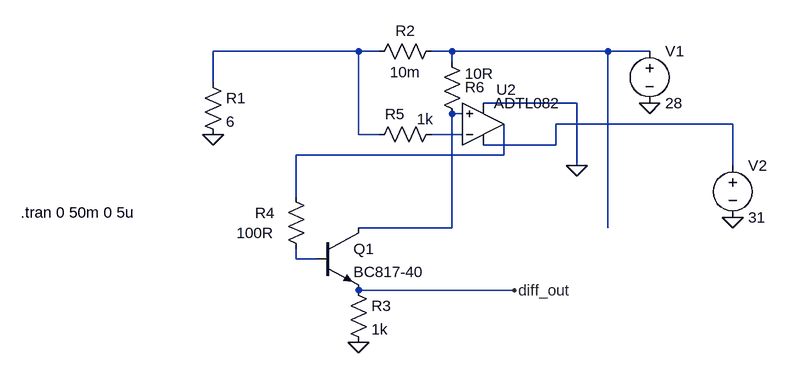
[diagram p0: schematic high_side_current_sense.asc]
high_side_current_sense.asc, the LTspice schematic file:
Version 4
SHEET 1 880 680
WIRE -16 32 -240 32
WIRE 16 32 -16 32
WIRE 128 32 96 32
WIRE 368 32 128 32
WIRE 432 32 368 32
WIRE 128 48 128 32
WIRE -240 80 -240 32
WIRE 320 112 176 112
WIRE 144 128 128 128
WIRE 560 144 288 144
WIRE -16 160 -16 32
WIRE 16 160 -16 160
WIRE 144 160 96 160
WIRE 288 176 288 144
WIRE 288 176 176 176
WIRE 208 192 208 144
WIRE 208 192 -112 192
WIRE 320 208 320 112
WIRE 560 208 560 144
WIRE -112 256 -112 192
WIRE 128 304 128 128
WIRE 128 304 -16 304
WIRE 368 304 368 32
WIRE -112 352 -112 336
WIRE -80 352 -112 352
WIRE 224 400 -16 400
FLAG 432 112 0
FLAG 320 208 0
FLAG -240 160 0
FLAG -16 480 0
FLAG 224 400 diff_out
FLAG 560 288 0
SYMBOL voltage 432 16 R0
WINDOW 123 0 0 Left 0
WINDOW 39 0 0 Left 0
SYMATTR InstName V1
SYMATTR Value 28
SYMBOL res -256 64 R0
SYMATTR InstName R1
SYMATTR Value 6
SYMBOL res 112 16 R90
WINDOW 0 0 56 VBottom 2
WINDOW 3 32 56 VTop 2
SYMATTR InstName R2
SYMATTR Value 10m
SYMBOL npn -80 304 R0
SYMATTR InstName Q1
SYMATTR Value BC817-40
SYMBOL res -32 384 R0
SYMATTR InstName R3
SYMATTR Value 1k
SYMBOL res 112 144 R90
WINDOW 0 0 72 VBottom 2
WINDOW 3 -23 25 VTop 2
SYMATTR InstName R5
SYMATTR Value 1k
SYMBOL res 112 32 R0
WINDOW 0 36 55 Left 2
WINDOW 3 36 34 Left 2
SYMATTR InstName R6
SYMATTR Value 10R
SYMBOL res -128 240 R0
WINDOW 0 -47 41 Left 2
WINDOW 3 -76 72 Left 2
SYMATTR InstName R4
SYMATTR Value 100R
SYMBOL voltage 560 192 R0
WINDOW 123 0 0 Left 0
WINDOW 39 0 0 Left 0
SYMATTR InstName V2
SYMATTR Value 31
SYMBOL OpAmps\\ADTL082 176 208 M180
WINDOW 0 20 117 Left 2
SYMATTR InstName U2
TEXT -536 280 Left 2 !.tran 0 50m 0 5u

The netlist it stands for:
* high_side_current_sense.asc
V1 N002 0 28
R1 N001 0 6
R2 N002 N001 10m
Q1 N003 N007 diff_out 0 BC817-40
R3 diff_out 0 1k
R5 N005 N001 1k
R6 N002 N003 10R
R4 N006 N007 100R
V2 N004 0 31
XU2 N003 N005 N004 0 N006 ADTL082  ; pins In+ In- V+ V- OUT
.model NPN NPN
.model PNP PNP
.lib standard.bjt
.tran 0 50m 0 5u
.lib ADI.lib
.backanno
.end